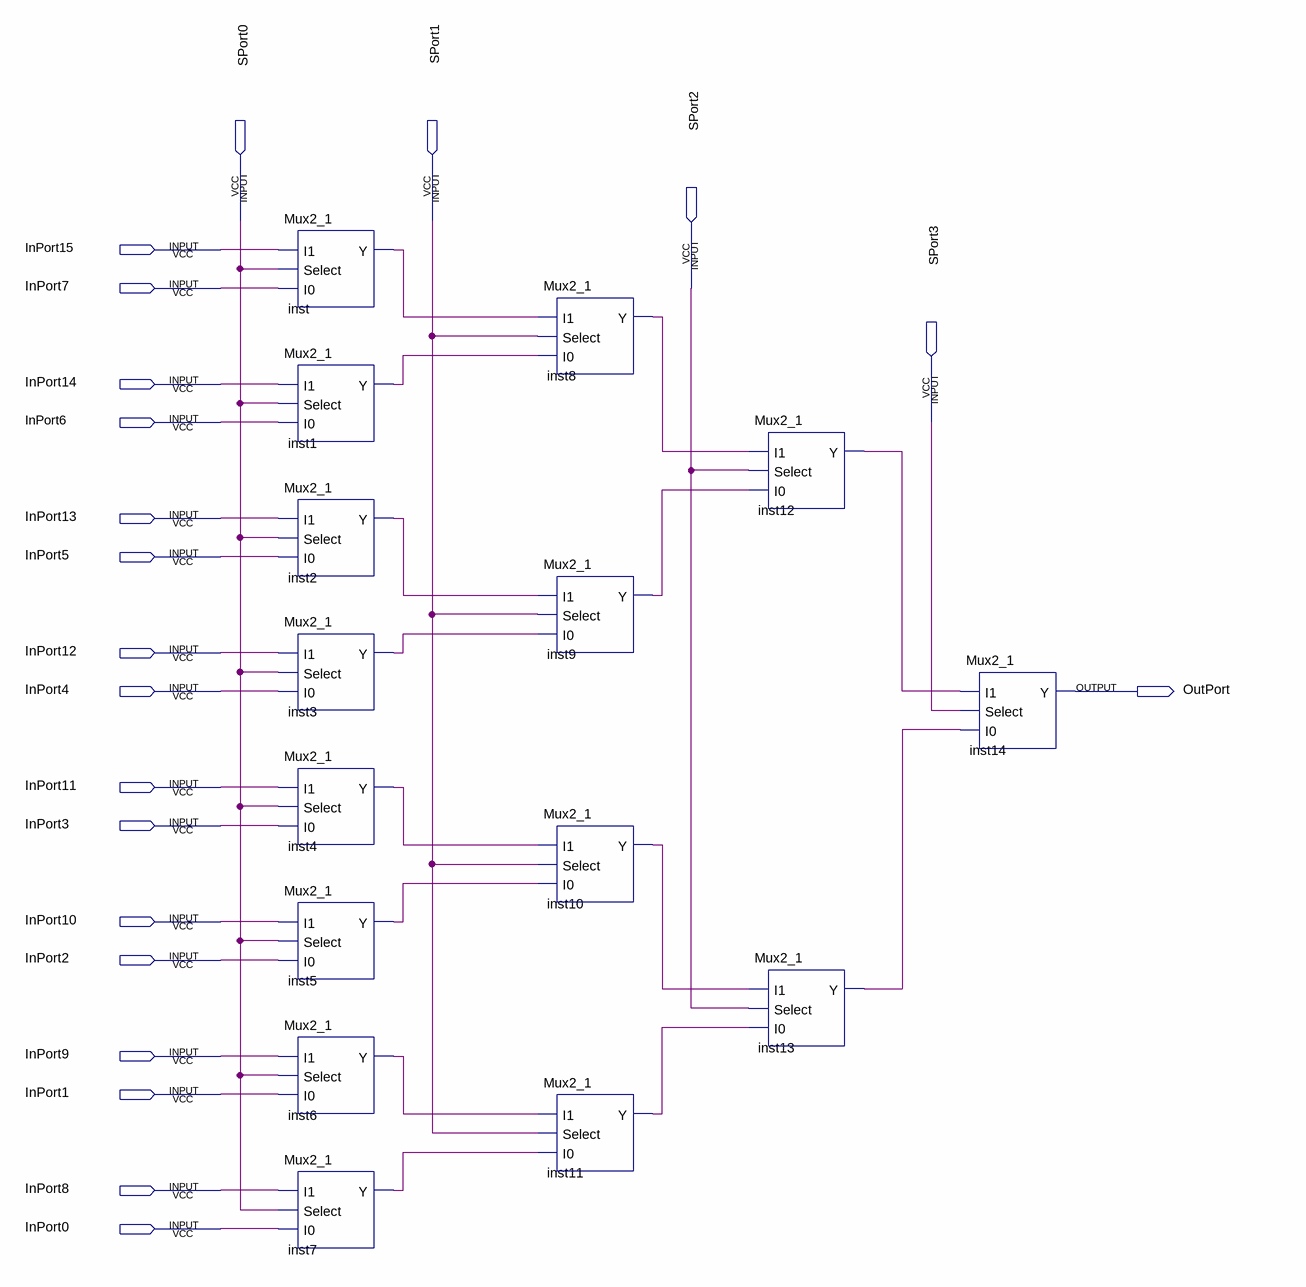
[diagram p0: schematic sheet]
// Quartus schematic Mux16_1.bdf as structural Verilog: 15 symbols, 21 pins
module Mux16_1 (
  input  SPort0,
  input  SPort1,
  input  InPort15,
  input  InPort7,
  input  SPort2,
  input  InPort14,
  input  InPort6,
  input  SPort3,
  input  InPort13,
  input  InPort5,
  input  InPort12,
  input  InPort4,
  input  InPort11,
  input  InPort3,
  input  InPort10,
  input  InPort2,
  input  InPort9,
  input  InPort1,
  input  InPort8,
  input  InPort0,
  output OutPort
);

  wire inst1_y, inst2_y, inst3_y, inst4_y, inst5_y, inst6_y, inst7_y, inst8_y, inst9_y, inst10_y, inst11_y,
       inst12_y, inst13_y, inst_y;

  Mux2_1 inst (.I1(InPort15), .Select(SPort0), .I0(InPort7), .Y(inst_y));
  Mux2_1 inst1 (.I1(InPort14), .Select(SPort0), .I0(InPort6), .Y(inst1_y));
  Mux2_1 inst2 (.I1(InPort13), .Select(SPort0), .I0(InPort5), .Y(inst2_y));
  Mux2_1 inst3 (.I1(InPort12), .Select(SPort0), .I0(InPort4), .Y(inst3_y));
  Mux2_1 inst4 (.I1(InPort11), .Select(SPort0), .I0(InPort3), .Y(inst4_y));
  Mux2_1 inst5 (.I1(InPort10), .Select(SPort0), .I0(InPort2), .Y(inst5_y));
  Mux2_1 inst6 (.I1(InPort9), .Select(SPort0), .I0(InPort1), .Y(inst6_y));
  Mux2_1 inst7 (.I1(InPort8), .Select(SPort0), .I0(InPort0), .Y(inst7_y));
  Mux2_1 inst8 (.I1(inst_y), .Select(SPort1), .I0(inst1_y), .Y(inst8_y));
  Mux2_1 inst9 (.I1(inst2_y), .Select(SPort1), .I0(inst3_y), .Y(inst9_y));
  Mux2_1 inst10 (.I1(inst4_y), .Select(SPort1), .I0(inst5_y), .Y(inst10_y));
  Mux2_1 inst11 (.I1(inst6_y), .Select(SPort1), .I0(inst7_y), .Y(inst11_y));
  Mux2_1 inst12 (.I1(inst8_y), .Select(SPort2), .I0(inst9_y), .Y(inst12_y));
  Mux2_1 inst13 (.I1(inst10_y), .Select(SPort2), .I0(inst11_y), .Y(inst13_y));
  Mux2_1 inst14 (.I1(inst12_y), .Select(SPort3), .I0(inst13_y), .Y(OutPort));
endmodule
